# EAGLE design Duckietown 2018C (EAGLE 8.5.2)
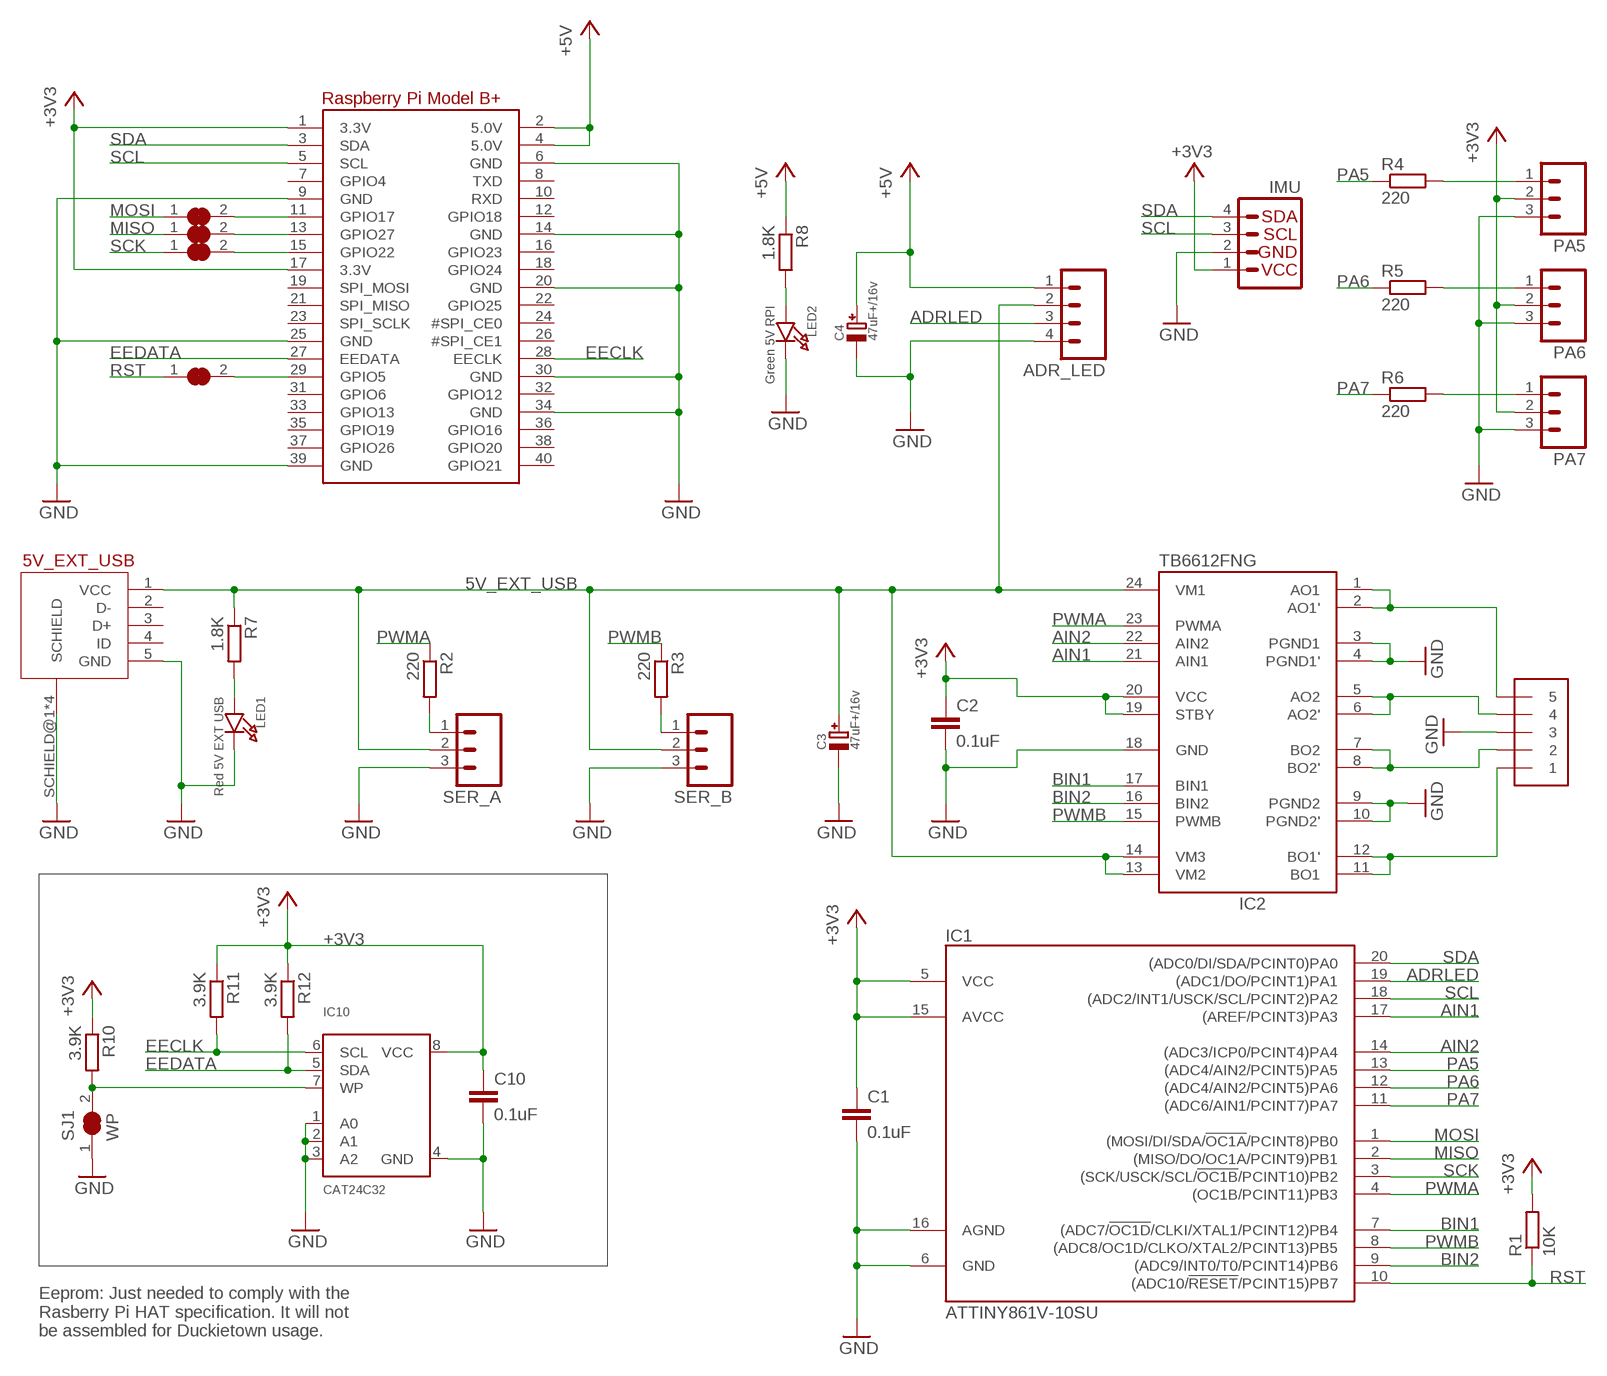
[diagram p0: schematic, sheet 1]

## Parts
5V_EXT_USB  MICROUSBCON  [MICROUSBCON]
ADR_LED  M04PTH  [1X04]
C1  0.1uF  C-EUC0603  [C0603]
C2  0.1uF  C-EUC0603  [C0603]
C3  47uF+/16v  CAP_ELECTROLYTICPANASONIC_C  [PANASONIC_C]
C4  47uF+/16v  CAP_ELECTROLYTICPANASONIC_C  [PANASONIC_C]
C10  0.1uF  C-EUC0603  [C0603]
IC1  ATTINY861V-10SU  [SO20L]
IC2  TB6612FNG  [SSOP24]
IC10  CAT24C32  EEPROM_I2C_SOIC8_GENERIC  [SOIC8_150MIL]
IMU  I2C_IMU_L3GD20H+LSM303  [1X04]
LED1  Red 5V EXT USB  LED0805_NOOUTLINE  [CHIPLED_0805_NOOUTLINE]
LED2  Green 5V RPI  LED0805_NOOUTLINE  [CHIPLED_0805_NOOUTLINE]
MOTA  1X5  [1X05-3.5MM]
PA5  M03PTH  [1X03]
PA6  M03PTH  [1X03]
PA7  M03PTH  [1X03]
R1  10K  R-EU_R0603  [R0603]
R2  220  R-EU_R0603  [R0603]
R3  220  R-EU_R0603  [R0603]
R4  220  R-EU_R0603  [R0603]
R5  220  R-EU_R0603  [R0603]
R6  220  R-EU_R0603  [R0603]
R7  1.8K  R-EU_R0603  [R0603]
R8  1.8K  R-EU_R0603  [R0603]
R10  3.9K  R-EU_R0603  [R0603]
R11  3.9K  R-EU_R0603  [R0603]
R12  3.9K  R-EU_R0603  [R0603]
RP_MISO  SOLDERJUMPER_CLOSED  [SOLDERJUMPER_CLOSEDWIRE]
RP_MOSI  SOLDERJUMPER_CLOSED  [SOLDERJUMPER_CLOSEDWIRE]
RP_RST  SOLDERJUMPER_CLOSED  [SOLDERJUMPER_CLOSEDWIRE]
RP_SCK  SOLDERJUMPER_CLOSED  [SOLDERJUMPER_CLOSEDWIRE]
RPI2  RASPBERRYPI_BPLUS_HATSLOTS  [PI_HAT_SLOTS]
SER_A  M03PTH  [1X03]
SER_B  M03PTH  [1X03]
SJ1  WP  SOLDERJUMPER_CLOSED  [SOLDERJUMPER_CLOSEDWIRE]

## Nets
5V_EXT_USB [Power]: 5V_EXT_USB.1(VCC) ADR_LED.2 C3.+ IC2.13(VM2) IC2.14(VM3) IC2.24(VM1) R7.1 SER_A.2 SER_B.2
+3V3 [Supply]: C1.1 C2.1 C10.1 IC1.5(VCC) IC1.15(AVCC) IC2.19(STBY) IC2.20(VCC) IC10.8(VCC) IMU.1 PA5.2 PA6.2 PA7.2 R1.2 R10.1 R11.1 R12.1 RPI2.1(3.3V) RPI2.17(3.3V)
+5V [Power]: ADR_LED.1 C4.+ R8.1 RPI2.2(5.0V) RPI2.4(5.0V)
ADRLED: ADR_LED.3 IC1.19((ADC1/DO/PCINT1)PA1)
AIN1: IC1.17((AREF/PCINT3)PA3) IC2.21(AIN1)
AIN2: IC1.14((ADC3/ICP0/PCINT4)PA4) IC2.22(AIN2)
BIN1: IC1.7((ADC7/!OC1D!/CLKI/XTAL1/PCINT12)PB4) IC2.17(BIN1)
BIN2: IC1.9((ADC9/INT0/T0/PCINT14)PB6) IC2.16(BIN2)
EECLK: IC10.6(SCL) R11.2 RPI2.28(EECLK)
EEDATA: IC10.5(SDA) R12.2 RPI2.27(EEDATA)
GND: 5V_EXT_USB.5(GND) 5V_EXT_USB.SCHIELD@1(SCHIELD) 5V_EXT_USB.SCHIELD@2(SCHIELD) 5V_EXT_USB.SCHIELD@3(SCHIELD) 5V_EXT_USB.SCHIELD@4(SCHIELD) ADR_LED.4 C1.2 C2.2 C3.- C4.- C10.2 IC1.6(GND) IC1.16(AGND) IC2.3(PGND1) IC2.4(PGND1') IC2.9(PGND2) IC2.10(PGND2') IC2.18(GND) IC10.1(A0) IC10.2(A1) IC10.3(A2) IC10.4(GND) IMU.2 LED1.C LED2.C MOTA.3 PA5.3 PA6.3 PA7.3 RPI2.6(GND) RPI2.9(GND) RPI2.14(GND) RPI2.20(GND) RPI2.25(GND) RPI2.30(GND) RPI2.34(GND) RPI2.39(GND) SER_A.3 SER_B.3 SJ1.1
MISO: IC1.2((MISO/DO/OC1A/PCINT9)PB1) RP_MISO.1
MOSI: IC1.1((MOSI/DI/SDA/!OC1A!/PCINT8)PB0) RP_MOSI.1
N$1: LED2.A R8.2
N$11 [Power]: IC2.5(AO2) IC2.6(AO2') MOTA.4
N$12 [Power]: IC2.7(BO2) IC2.8(BO2') MOTA.2
N$13: LED1.A R7.2
N$16: IC10.7(WP) R10.2 SJ1.2
N$17 [Power]: IC2.11(BO1) IC2.12(BO1') MOTA.1
N$18 [Power]: IC2.1(AO1) IC2.2(AO1') MOTA.5
N$20: R2.2 SER_A.1
N$22: PA5.1 R4.2
N$23: R3.2 SER_B.1
N$24: PA6.1 R5.2
N$25: PA7.1 R6.2
N$43: RP_SCK.2 RPI2.15(GPIO22)
N$44: RP_MISO.2 RPI2.13(GPIO27)
N$46: RP_MOSI.2 RPI2.11(GPIO17)
N$48: RP_RST.2 RPI2.29(GPIO5)
PA5: IC1.13((ADC4/AIN2/PCINT5)PA5) R4.1
PA6: IC1.12((ADC4/AIN2/PCINT5)PA6) R5.1
PA7: IC1.11((ADC6/AIN1/PCINT7)PA7) R6.1
PWMA: IC1.4((OC1B/PCINT11)PB3) IC2.23(PWMA) R2.1
PWMB: IC1.8((ADC8/OC1D/CLKO/XTAL2/PCINT13)PB5) IC2.15(PWMB) R3.1
RST: IC1.10((ADC10/!RESET!/PCINT15)PB7) R1.1 RP_RST.1
SCK: IC1.3((SCK/USCK/SCL/!OC1B!/PCINT10)PB2) RP_SCK.1
SCL: IC1.18((ADC2/INT1/USCK/SCL/PCINT2)PA2) IMU.3 RPI2.5(SCL)
SDA: IC1.20((ADC0/DI/SDA/PCINT0)PA0) IMU.4 RPI2.3(SDA)
Unconnected: 5V_EXT_USB.2(D-) 5V_EXT_USB.3(D+) 5V_EXT_USB.4(ID) RPI2.7(GPIO4) RPI2.8(TXD) RPI2.10(RXD) RPI2.12(GPIO18) RPI2.16(GPIO23) RPI2.18(GPIO24) RPI2.19(SPI_MOSI) RPI2.21(SPI_MISO) RPI2.22(GPIO25) RPI2.23(SPI_SCLK) RPI2.24(#SPI_CE0) RPI2.26(#SPI_CE1) RPI2.31(GPIO6) RPI2.32(GPIO12) RPI2.33(GPIO13) RPI2.35(GPIO19) RPI2.36(GPIO16) RPI2.37(GPIO26) RPI2.38(GPIO20) RPI2.40(GPIO21)

## Notes on the sheet
- Eeprom: Just needed to comply with the
  Rasberry Pi HAT specification. It will not
  be assembled for Duckietown usage.

## Library data of the parts
5V_EXT_USB = USB Connector:MICROUSBCON: Digi-Key 609-4618-1-ND Amphenol FCI 10118194-0001LF Description CONN USB MICRO B RECPT SMT R/A
ADR_LED = DuckietownTrafficLight:M04: Header 4 Standard 4-pin 0.1" header. Use with straight break away headers (SKU : PRT-00116), right angle break away headers (PRT-00553), swiss pins (PRT-00743), machine pins (PRT-00117), and female headers (PRT-00115). Molex polarized connector foot print use with SKU : PRT-08231 with associated crimp pins and housings. 1MM SMD Version SKU: PRT-10208
C1 C2 C10 = rcl:C-EU: CAPACITOR, European symbol; SPICEPREFIX: C
C3 C4 = microbuilder:CAP_ELECTROLYTIC: Electrolytic Capacitors SMT PANASONIC_C - Size C Panasonic Electrolytic Aluminum Capacitor 47µF 16V 20% Electrolytic Capacitor [Digikey: PCE3890TR-ND] PANASONIC_D - Size D Panasonic Electrolytic Aluminum Capacitor 100µF 25V 20% Electrolytic Capacitor [Digikey: PCE3898TR-ND] PTH 3.5 mm grid, 8 mm diameter ... 3.5 mm grid, 10 mm diameter ...
IC1 = Attiny86:ATTINY861V-10SU
IC2 = DuckietownTrafficLight:TB6612FNG: TB6612FNG MOS dual H-bridge motor driver, 1.2A current 3.2A peak 3 or 5v logic and 3-15v motor
IC10 = microbuilder:EEPROM_I2C_SOIC8_GENERIC: Note: The same pinout is used for many I2C EEPROMs in SOIC8(150mil) from a variety of manufacturers and in various sizes. Examples: 16K (2K x 8 Bit) I2C EEPROM 1.7-5.5V, 400KHz, -40°C-85°C Digikey: CAT24C16WI-GT3CT-ND 256K (32K x 8 Bit) I2C EEPROM 1.7-5.5V, 400KHz, -40°C-85°C Digikey: 24AA256-I/SN-ND
IMU = cambridge_garage_electronics:I2C_IMU_L3GD20H+LSM303: SparkFun has standardized on a pinout for all I2C based sensor breakouts. This pinout allows I2C boards to be plugged directly into the headers on Arduino Uno compatible boards, and to be daisy chained easily.
LED1 LED2 = microbuilder:LED: LED 0603 - 0603 Surface Mount Package 2mA: Green LED - Low Power (3.9mcd, 2ma, 1.7Vf) - Digikey: 475-2709-2-ND Orange LED - Low Power (9.8mcd, 2ma, 1.8Vf) - Digikey: 475-1194-2-ND Red LED - Low Power (5mcd, 2ma, 1.8Vf) - Digikey: 475-1195-2-ND Yellow LED - Low Power (7mcd, 2ma, 1.8Vf) - Digikey: 475-1196-2-ND 5mA: Blue LED - Low Power (17mcd, 5ma, 2.9Vf) - Digikey: LNJ937W8CRACT-ND 0805 - 0805 Surface Mount Package 2mA: Red LED (8.8mcd, 2mA, 1.8Vf, Clear) - Low Power [Digikey: 475-2510-1-ND] Green LED (5mcd, 2mA, 1.8Vf, Clear) - Low Power [Digikey: 475-2730-1-ND] Yellow LED (11.3mcd, 2mA, 1.8Vf, Clear) - Low Power [Digikey: 475-2555-1-ND] 20mA: Red LED (104mcd, 20mA, Diffused) - LS R976 [Digikey: 475-1278-6-ND] Red LED (12mcd, 20mA, 2.0Vf, Clear) - APT2012EC [Digikey: 754-1128-1-ND] Green LED (15mcd, 20mA, 2.2Vf, Clear) - APT2012GC [Digikey: 754-1131-1-ND] Orange LED (160mcd, 20mA, 2.1Vf, Clear) - APT2012SECK [Digikey: 754-1130-1-ND] 1206 - 1206 Surface Mount Package Green LED (26mcd, 20mA, Diffused) - LG N971 [Digikey: 475-1407-6-ND] Red LED (15mcd, 20mA, Diffused) - LH N974 [Digikey: 475-1416-6-ND] Cree - Cree High-Power Surface Mount LEDs XPEBWT-L1-0000-00D50 - White 111lm 350mA 2.9Vf 6200K 110° XTEAWT-00-0000-00000LEE3 - White 114lm 350mA 2.85Vf 5000K 115° Everlight - Everlight 45-21 Series Surface Mount LEDs 45-21/QK2C-B2832AC2CB2/2T - Warm White 2000mcd 20mA 3.25Vf 3050K 120° 45-21/LK2C-B38452C4CB2/2T - Nuetral White 2000mcd 20mA 3.25Vf 4150K 120° 45-21/LK2C-B50634C6CB2/2T - Cold White 2200mcd 20mA 3.25Vf 5650K 120° PLCC2 Reverse Mount LS T77K-J1L2-1-0-2-R18-Z - Red 11.25mcd 2mA 1.8Vf 630nm 120° LO T77K-L1M2-24-Z - Orange 19.6mcd 2mA 1.8Vf 606nm 120° LY T77K-K2M1-26-Z - Yellow 15.7mcd 2mA 1.8Vf 587nm 120°
MOTA = DuckietownTrafficLight:1X5
PA5-PA7 SER_A SER_B = cambridge_garage_electronics:M03: Header 3 Standard 3-pin 0.1" header. Use with straight break away headers (SKU : PRT-00116), right angle break away headers (PRT-00553), swiss pins (PRT-00743), machine pins (PRT-00117), and female headers (PRT-00115). Molex polarized connector foot print use with SKU : PRT-08232 with associated crimp pins and housings.
R1-R8 R10-R12 = rcl:R-EU_: RESISTOR, European symbol; SPICEPREFIX: R
RP_MISO RP_MOSI RP_RST RP_SCK SJ1 = DuckietownTrafficLight:SOLDERJUMPER_CLOSED: Solder Jumper - Closed These solder jumpers are closed by default CLOSEDWIRE - 10 mil trace between pads that can be cut and resoldered later CLOSEDPERM - 63 mil trace between pads for a permanent connection (used to 'bridge' two signals, a shameless hack for Eagle). Can double as a test point as well (no cream layer)
RPI2 = DuckietownTrafficLight:RASPBERRYPI_BPLUS

## Net classes
0 default: width 0.406 mm, drill 0.406 mm
1 Power: width 0.813 mm, drill 0.813 mm
2 Supply: width 0.61 mm, drill 0.61 mm

## Board
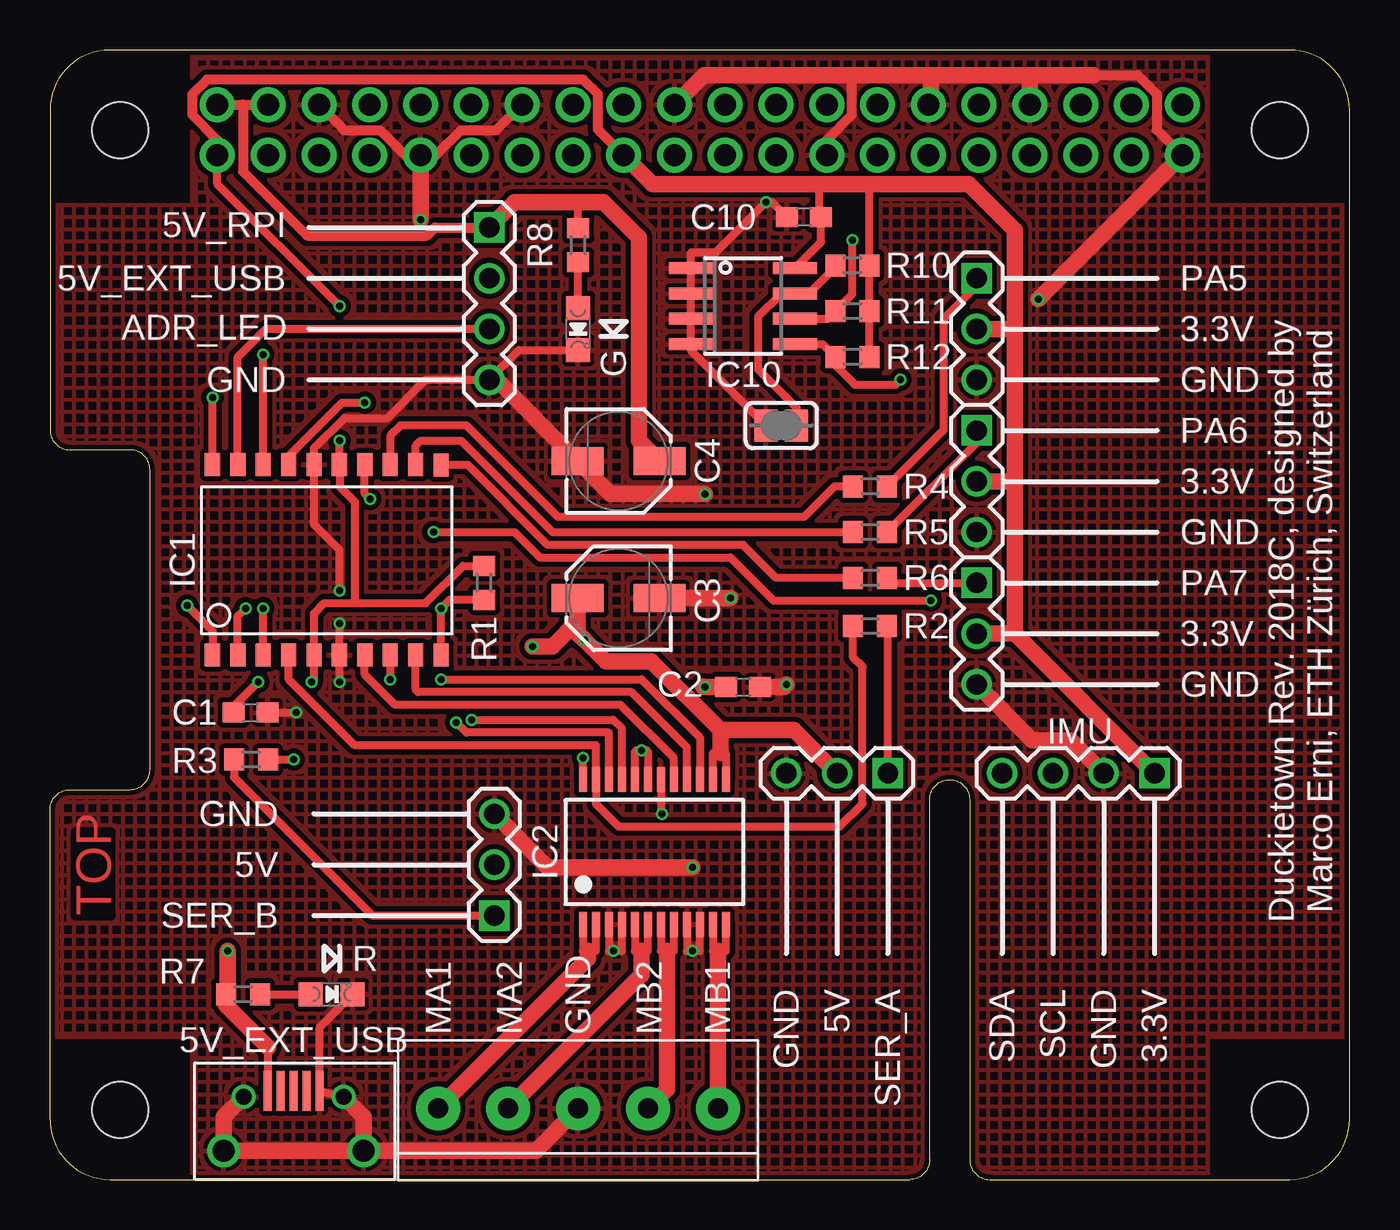
[diagram p1: board, top side]
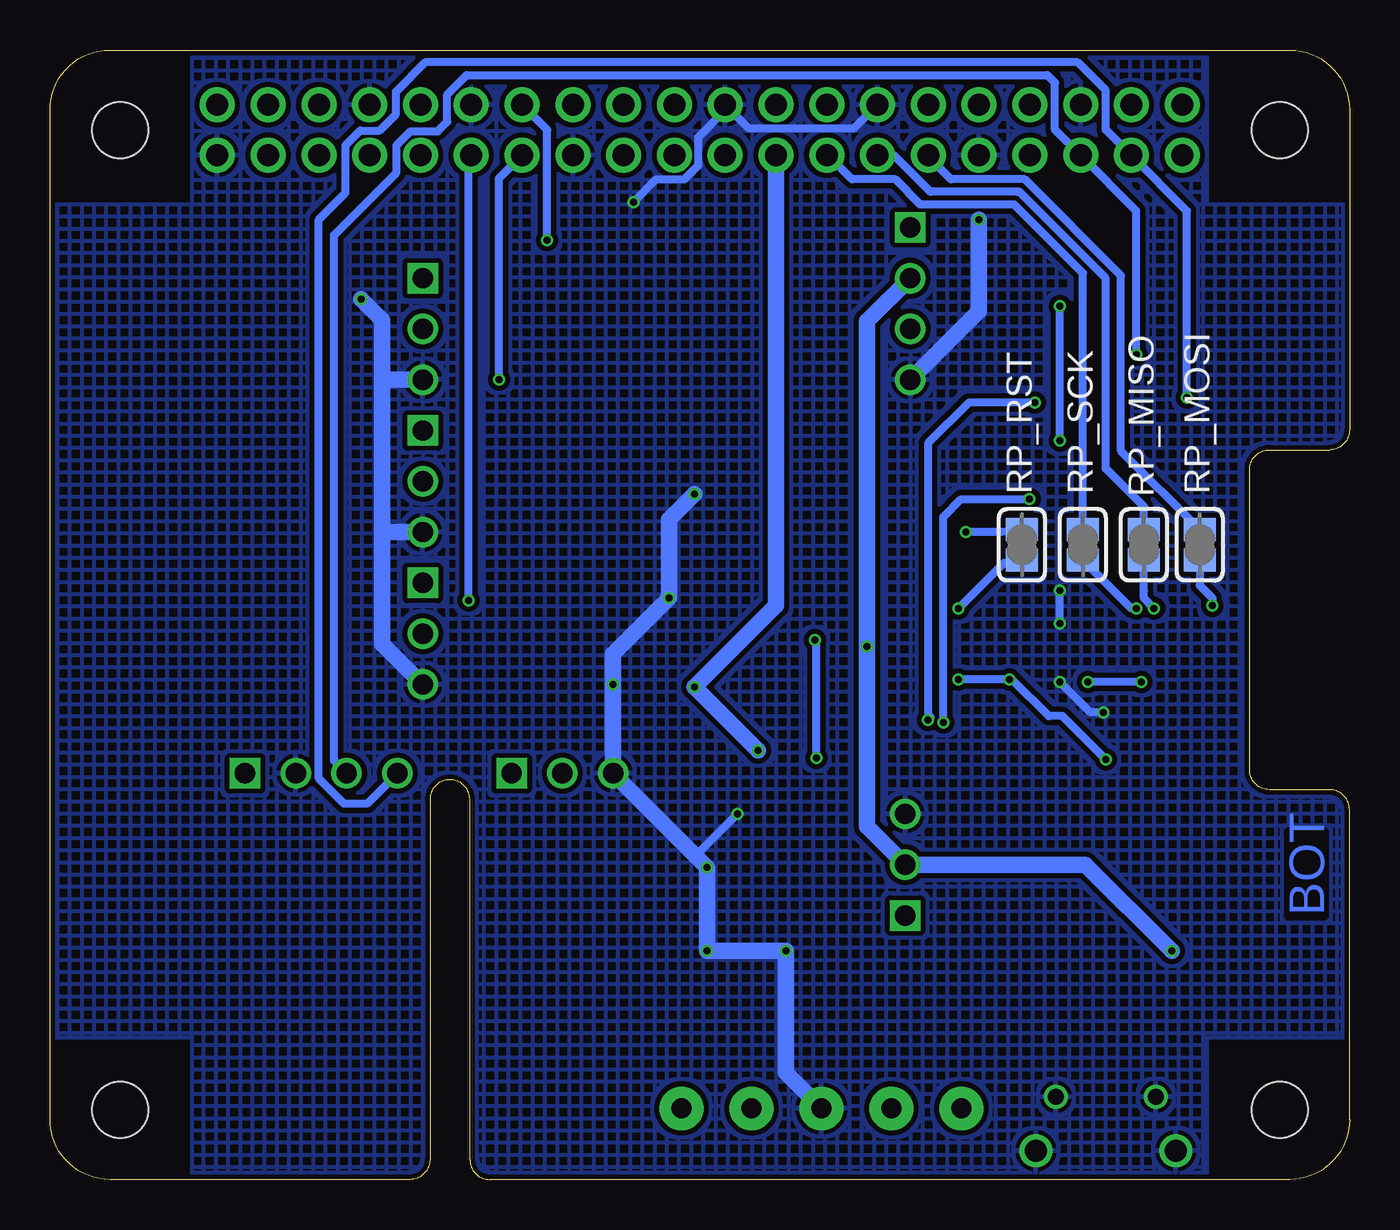
[diagram p2: board, bottom side, seen from below]

Size 65 x 56.5 mm. Coordinates in mm from the lower left corner, seen from the top.
Copper layers (1*16): Top 0.018mm / dielectric 1.55mm / Bottom 0.018mm
Design rules "Multi-CB_2L_125um-Tracks_OL35um *": minimum track width 0.125mm, minimum drill 0.2mm, track to track 0.125mm, track to pad 0.125mm, pad to pad 0.125mm, via to via 0.125mm, smd to smd 0mil, copper to edge 0.2mm, drill to drill 0.2mm, minimum pad ring 0.125mm, minimum via ring 0.125mm, stop-mask expansion 2mil, vias tented up to drill 0.45mm, thermal gap 0.2mm

### Footprints (pad centres in the part's own frame; a part is rotated, then mirrored left to right if it is on the bottom)
MICROUSBCON = smd 0.4 x 2: 1 -1.3,4.45; 2 -0.65,4.45; 3 0,4.45; 4 0.65,4.45; 5 1.3,4.45 | drill 0.8: SCHIELD@1 -2.5,4.15; SCHIELD@2 2.5,4.15 | drill 1.1: SCHIELD@3 -3.5,1.45; SCHIELD@4 3.5,1.45
1X04 = drill 1.016 pad 1.524 square: 1 0,0 | drill 1.016 pad 1.524: 2 2.54,0; 3 5.08,0; 4 7.62,0
C0603 = smd 1.1 x 1: 1 -0.85,0; 2 0.85,0
PANASONIC_C = smd 2.6 x 1.4: + 2.05,0; - -2.05,0
SO20L = smd 0.762 x 1.143: 1 -5.08,-5.131; 2 -3.81,-5.131; 3 -2.54,-5.131; 4 -1.27,-5.131; 5 0,-5.131; 6 1.27,-5.131; 7 2.54,-5.131; 8 3.81,-5.131; 9 5.08,-5.131; 10 6.35,-5.131; 11 6.35,4.369; 12 5.08,4.394; 13 3.81,4.394; 14 2.54,4.394; 15 1.27,4.394; 16 0,4.394; 17 -1.27,4.394; 18 -2.54,4.394; 19 -3.81,4.394; 20 -5.08,4.394
SSOP24 = smd 0.4 x 1.25: 1 -3.575,-3.625; 2 -2.925,-3.625; 3 -2.275,-3.625; 4 -1.625,-3.625; 5 -0.975,-3.625; 6 -0.325,-3.625; 7 0.325,-3.625; 8 0.975,-3.625; 9 1.625,-3.625; 10 2.275,-3.625; 11 2.925,-3.625; 12 3.575,-3.625; 13 3.575,3.625; 14 2.925,3.625; 15 2.275,3.625; 16 1.625,3.625; 17 0.975,3.625; 18 0.325,3.625; 19 -0.325,3.625; 20 -0.975,3.625; 21 -1.625,3.625; 22 -2.275,3.625; 23 -2.925,3.625; 24 -3.575,3.625
SOIC8_150MIL = smd 0.6 x 2.2: 1 -1.905,-2.6; 2 -0.635,-2.6; 3 0.635,-2.6; 4 1.905,-2.6; 5 1.905,2.6; 6 0.635,2.6; 7 -0.635,2.6; 8 -1.905,2.6
CHIPLED_0805_NOOUTLINE = smd 1.2 x 1.2: A 0,-1.05; C 0,1.05
1X05-3.5MM = drill 1 pad 2.184: 1 7,0; 2 3.5,0; 3 0,0; 4 -3.5,0; 5 -7,0
1X03 = drill 1.016 pad 1.524 square: 1 0,0 | drill 1.016 pad 1.524: 2 2.54,0; 3 5.08,0
R0603 = smd 1 x 1.1: 1 -0.85,0; 2 0.85,0
SOLDERJUMPER_CLOSEDWIRE = smd 1.168 x 1.6: 1 -0.762,0; 2 0.762,0 | smd 0.635 x 0.305: WIRE 0,0
PI_HAT_SLOTS = drill 1.1 pad 1.75: 1 8.37,51.23; 2 8.37,53.77; 3 10.91,51.23; 4 10.91,53.77; 5 13.45,51.23; 6 13.45,53.77; 7 15.99,51.23; 8 15.99,53.77; 9 18.53,51.23; 10 18.53,53.77; 11 21.07,51.23; 12 21.07,53.77; 13 23.61,51.23; 14 23.61,53.77; 15 26.15,51.23; 16 26.15,53.77; 17 28.69,51.23; 18 28.69,53.77; 19 31.23,51.23; 20 31.23,53.77; 21 33.77,51.23; 22 33.77,53.77; 23 36.31,51.23; 24 36.31,53.77; 25 38.85,51.23; 26 38.85,53.77; 27 41.39,51.23; 28 41.39,53.77; 29 43.93,51.23; 30 43.93,53.77; 31 46.47,51.23; 32 46.47,53.77; 33 49.01,51.23; 34 49.01,53.77; 35 51.55,51.23; 36 51.55,53.77; 37 54.09,51.23; 38 54.09,53.77; 39 56.63,51.23; 40 56.63,53.77 | hole 2.8: 3.5,3.5; 3.5,52.5; 61.5,52.5; 61.5,3.5

### Placement (x,y rotation side)
5V_EXT_USB  12.19,0 0 top
ADR_LED  21.97,47.62 270 top
C1  10.03,23.37 0 top
C2  34.67,24.64 0 top
C3  28.45,29.08 180 top
C4  28.45,35.94 0 top
C10  37.72,48.13 180 top
IC1  13.21,31.37 0 top
IC2  30.23,16.38 0 top
IC10  34.67,43.69 270 top
IMU  55.24,20.32 180 top
LED1  14.1,9.27 270 top
LED2  26.42,42.55 180 top
MOTA  26.42,3.56 0 top
PA5  46.35,45.09 270 top
PA6  46.35,37.47 270 top
PA7  46.35,29.84 270 top
R1  21.72,29.84 90 top
R2  41.02,27.69 0 top
R3  10.06,21.01 180 top
R4  41.02,34.67 0 top
R5  41.02,32.38 0 top
R6  41.02,30.1 0 top
R7  9.65,9.27 0 top
R8  26.42,46.74 270 top
R10  40.13,45.72 180 top
R11  40.13,43.43 180 top
R12  40.13,41.15 180 top
RP_MISO  10.29,31.75 90 bottom
RP_MOSI  7.49,31.75 90 bottom
RP_RST  16.38,31.75 90 bottom
RP_SCK  13.34,31.75 90 bottom
RPI2  0,0 0 top
SER_A  41.91,20.32 180 top
SER_B  22.23,13.21 90 top
SJ1  36.58,37.72 0 top

### Tracks (layer width: path | path; a pad name or v marks a point on that pad's centre or on a via)
5V_EXT_USB  (via drill 0.35)
  Top 0.406: IC2.14 33.15,21.33 | 33.15,21.33 33.15,21.34 | 33.78,21.34 33.79,21.33 | IC2.13 33.8,21.32 33.79,21.33 | 33.15,21.33 33.53,21.33 33.79,21.33 | IC2.24 26.65,21.06 v26.67,21.08 | 10.92,6.6 10.89,6.57 5V_EXT_USB.1
  Top 0.813: 33.53,21.33 33.53,22.48 | 26.4,27.94 26.4,27.32 v26.73,26.99 27.81,25.91 30.1,25.91 33.53,22.48 | 26.4,27.94 C3.+ | SER_A.2 37.21,22.48 33.53,22.48 | 26.4,27.94 25.13,26.67 v24.13,26.67 | v8.89,11.43 8.89,9.36 R7.1 8.8,8.72 10.92,6.6
  Bottom 0.406: v26.67,21.08 26.67,26.92 v26.73,26.99
  Bottom 0.813: ADR_LED.2 24.13,42.93 v24.13,26.67 24.13,17.65 SER_B.2 13.21,15.75 v8.89,11.43
+3V3  (via drill 0.35)
  Top 0.406: R12.1 R11.1 R10.1 40.98,49.44 40.64,49.78 | v13.08,24.89 13.21,25.02 IC1.5 13.21,28.32 13.72,28.83 15.24,28.83 | R1.2 20.66,30.7 18.8,28.83 15.24,28.83 | 15.24,28.83 15.24,33.91 14.48,34.67 IC1.15 v14.48,36.96 | IC2.20 29.25,21.38 29.34,21.46 v29.59,21.46 29.84,21.46 29.9,21.41 IC2.19 | IC10.8 38.57,46.89 C10.1 38.48,48.22 38.48,49.78 | C1.1 9.18,23.66 v10.41,24.89 | v14.48,43.69 8.37,49.8 RPI2.1
  Top 0.508: RPI2.17 27.4,52.52 27.4,54.29 26.67,55.02 7.85,55.02 7.12,54.29 7.12,53.25 8.37,52 RPI2.1
  Top 0.813: C2.1 v32.77,24.64 32.7,24.64 32.67,24.67 | RPI2.17 30.14,49.78 38.48,49.78 40.64,49.78 45.97,49.78 48.26,47.5 48.26,42.55 | 48.26,42.55 48.26,35.05 | 48.26,35.05 48.26,27.3 | PA6.2 48.13,34.92 48.26,35.05 | PA5.2 48.26,42.55 | IMU.1 48.26,27.3 | PA7.2 48.26,27.3
  Bottom 0.406: v10.41,24.89 v13.08,24.89 | v14.48,36.96 v14.48,43.69
  Bottom 0.813: v29.59,21.46 v32.77,24.64 28.69,28.71 RPI2.17
+5V
  Top 0.406: R8.1 26.42,48.9
  Top 0.508: RPI2.2 9.65,53.77 | 9.65,53.77 RPI2.4 | 9.65,53.77 9.65,50.42 12.85,47.22 18.86,47.22 19.26,47.62 ADR_LED.1
  Top 0.813: C4.+ 29.46,36.98 29.46,47.12 27.69,48.9 26.42,48.9 23.24,48.9 ADR_LED.1
ADRLED
  Top 0.406: ADR_LED.3 10.79,42.55 9.4,41.15 IC1.19
AIN1  (via drill 0.35)
  Top 0.406: IC2.21 28.6,22.58 28.19,22.99 v21.08,22.99 | IC1.17 11.94,36.2 14.61,38.86 v15.75,38.86
  Bottom 0.406: 20.95,23.12 v21.08,22.99 21.08,36.83 19.05,38.86 v15.75,38.86
AIN2  (via drill 0.35)
  Top 0.406: v16,34.04 15.75,34.29 IC1.14 | IC2.22 27.95,22.34 27.94,22.35 20.83,22.35 v20.32,22.86
  Bottom 0.406: v20.32,22.86 20.32,33.15 19.43,34.04 v16,34.04
BIN1
  Top 0.406: IC2.17 31.2,21.08 28.53,23.75 17.27,23.75 15.75,25.27 IC1.7
BIN2
  Top 0.406: IC2.16 31.85,21.62 29.08,24.38 18.41,24.38 18.29,24.51 IC1.9
EECLK  (via drill 0.35)
  Top 0.406: IC10.6 38.9,43.05 R11.2 40.13,44.28 v40.13,46.99
  Bottom 0.406: v40.13,46.99 40.13,52.51 RPI2.28
EEDATA  (via drill 0.35)
  Top 0.406: IC10.5 38.65,41.78 R12.2 39.28,40.73 40.26,39.75 42.29,39.75 v42.55,40.01
  Bottom 0.406: RPI2.27 42.55,50.08 v42.55,40.01
GND  (via drill 0.35)
  Top 0.406: IC2.9 31.85,11.43 v32.13,11.43 32.5,11.43 IC2.10 | IC2.3 27.95,11.43 v28.19,11.43 28.6,11.43 IC2.4 | C1.2 v12.32,23.37 | v14.48,24.89 IC1.6 v14.48,27.81 | v14.48,29.46 14.48,31.5 13.21,32.77 IC1.16 13.21,36.58 14.73,38.1 16.89,38.1 18.8,40.01 ADR_LED.4 23.46,41.49 LED2.C 26.32,41.4 | IC2.18 30.55,18.34 v30.61,18.29 | 5V_EXT_USB.SCHIELD@2 5V_EXT_USB.5 13.49,7.62 LED1.C | SJ1.1 32.07,41.46 IC10.4 IC10.3 IC10.2 IC10.1 32.07,46.38 33.3,46.38 v35.81,48.9 36.11,48.9 C10.2
  Top 0.508: RPI2.6 14.74,52.48 16.51,52.48 17.76,51.23 RPI2.9 19.3,51.23 20.55,52.48 22.32,52.48 RPI2.14 | RPI2.25 38.85,52 40.1,53.25 40.1,55.09 40.26,55.24 | 52.2,55.24 54.41,55.24 55.36,54.3 55.36,52.5 RPI2.39
  Top 0.813: 5V_EXT_USB.SCHIELD@1 8.69,3.15 5V_EXT_USB.SCHIELD@3 5V_EXT_USB.SCHIELD@4 | 5V_EXT_USB.SCHIELD@4 15.69,3.15 5V_EXT_USB.SCHIELD@2 | 5V_EXT_USB.SCHIELD@4 24.31,1.45 MOTA.3 | C2.2 36.7,24.64 v36.83,24.77 | RPI2.9 v18.53,48.01 | PA7.3 49.15,21.97 51.05,21.97 IMU.2 | RPI2.20 32.7,55.24 40.26,55.24 44.07,55.24 | 44.07,55.24 49.02,55.24 | 49.02,55.24 52.2,55.24 | RPI2.30 44.07,53.91 44.07,55.24 | RPI2.34 49.02,53.78 49.02,55.24 | v49.44,44.04 RPI2.39 | v32.77,34.29 28.05,34.29 C4.- 22.33,40.01 ADR_LED.4 | C3.- v34.04,29.08 | SER_B.3 24.89,15.62 v32.13,15.62
  Bottom 0.406: v12.32,23.37 12.95,23.37 v14.48,24.89 | v14.48,27.81 v14.48,29.46 | v30.61,18.29 32.7,16.19 | RPI2.14 24.81,52.57 30.03,52.57 RPI2.20 31.23,53.48 32.57,52.14 32.57,50.73 33.27,50.03 34.68,50.03 v35.81,48.9
  Bottom 0.813: MOTA.3 28.19,5.33 v28.19,11.43 v32.13,11.43 v32.13,15.62 32.7,16.19 SER_A.3 v36.83,24.77 36.83,26.29 v34.04,29.08 34.04,33.02 v32.77,34.29 | PA7.3 48.39,26.8 48.39,32.38 | v49.44,44.04 48.39,42.99 48.39,40.01 | 48.39,32.38 48.39,40.01 | PA6.3 48.39,32.38 | PA5.3 48.39,40.01 | ADR_LED.4 18.54,43.43 18.54,47.99 v18.53,48.01
  pour Top (isolate 0.254, hatched): 7.11,0 7.11,7.11 0,7.11 0,48.77 7.11,48.77 7.11,56.39 57.91,56.39 57.91,48.77 65.02,48.77 65.02,7.11 57.91,7.11 57.91,0
  pour Bottom (isolate 0.254, hatched): 7.11,0 7.11,7.11 0,7.11 0,48.77 7.11,48.77 7.11,56.39 57.91,56.39 57.91,48.77 65.02,48.77 65.02,7.11 57.91,7.11 57.91,0
MISO  (via drill 0.35)
  Top 0.406: v9.78,28.57 9.4,28.19 IC1.2
  Bottom 0.406: 10.29,29.46 RP_MISO.1 10.29,29.08 v9.78,28.57
MOSI  (via drill 0.35)
  Top 0.406: v6.86,28.7 8.13,27.43 IC1.1
  Bottom 0.406: RP_MOSI.1 7.49,29.72 6.86,29.08 v6.86,28.7
N$1
  Top 0.406: LED2.A R8.2
N$11
  Top 0.406: IC2.6 29.9,11.43 29.59,11.43 29.25,11.43 IC2.5
  Top 0.813: MOTA.4 29.59,10.23 29.59,11.43
N$12
  Top 0.406: IC2.7 30.55,11.43 30.86,11.43 31.2,11.43 IC2.8
  Top 0.813: MOTA.2 30.86,4.5 30.86,11.43
N$13
  Top 0.406: R7.2 LED1.A
N$16
  Top 0.406: R10.2 39.28,45.63 37.97,44.32 IC10.7 36.58,44.32 35.43,43.18 35.43,40.51 37.34,38.61 SJ1.2
N$17
  Top 0.406: IC2.11 33.15,11.43 33.4,11.43 | IC2.12 33.8,11.43 33.42,11.43
  Top 0.813: MOTA.1 33.42,11.43 33.4,11.43
N$18
  Top 0.406: IC2.1 26.65,11.43 26.92,11.43 27.3,11.43 IC2.2
  Top 0.813: MOTA.5 26.92,11.06 26.92,11.43
N$20
  Top 0.406: R2.2 41.91,27.65 SER_A.1
N$22
  Top 0.406: R4.2 44.7,37.5 44.7,43.05 46.35,44.7 PA5.1
N$23
  Top 0.406: R3.2 9.21,20.12 16.12,13.21 SER_B.1
N$24
  Top 0.406: R5.2 46.35,36.87 PA6.1
N$25
  Top 0.406: R6.2 42.12,29.84 PA7.1
N$43
  Bottom 0.406: RPI2.15 26.08,51.23 24.88,50.03 22.72,50.03 21.46,48.77 16.76,48.77 13.34,45.34 RP_SCK.2
N$44
  Bottom 0.406: RPI2.13 22.78,51.23 20.95,49.4 16.64,49.4 16.51,49.4 12.19,45.09 12.19,35.56 10.29,33.66 RP_MISO.2
N$46
  Bottom 0.406: RPI2.11 21.07,51.17 19.93,50.03 16.25,50.03 11.43,45.21 11.43,36.45 RP_MOSI.2
N$48  (via drill 0.35)
  Top 0.406: v19.18,32.38 23.24,32.38 24.51,31.11 34.04,31.11 36.2,28.96 v44.07,28.96
  Bottom 0.406: RP_RST.2 17.39,32.4 17.56,32.4 17.57,32.38 v19.18,32.38 | v44.07,28.96 44.07,51.09 RPI2.29
PA5
  Top 0.406: R4.1 39.24,34.67 37.72,33.15 25.4,33.15 20.83,37.72 17.53,37.72 17.02,37.21 IC1.13
PA6
  Top 0.406: IC1.12 18.29,36.7 18.54,36.96 20.57,36.96 25.15,32.38 R5.1
PA7
  Top 0.406: R6.1 36.32,30.1 34.67,31.75 24.89,31.75 20.9,35.74 IC1.11
PWMA
  Top 0.406: IC1.4 11.94,25.02 15.24,21.72 27.3,21.72 27.3,21.71 IC2.23 27.3,18.8 28.45,17.65 39.5,17.65 40.64,18.8 40.64,25.65 40.17,26.12 R2.1
PWMB  (via drill 0.35)
  Top 0.406: IC1.8 v17.02,25.02 | IC2.15 32.5,22.11 29.59,25.02 v19.56,25.02 | R3.1 v12.19,21.01
  Bottom 0.406: v12.19,21.01 14.36,23.18 15.05,23.18 16.89,25.02 v17.02,25.02 v19.56,25.02
RST  (via drill 0.35)
  Top 0.406: IC1.10 v19.56,28.57 19.98,29 R1.1
  Bottom 0.406: v19.56,28.57 17.27,30.86 RP_RST.1
SCK  (via drill 0.35)
  Top 0.406: IC1.3 v10.67,28.57
  Bottom 0.406: v10.67,28.57 10.92,28.57 RP_SCK.1
SCL  (via drill 0.35)
  Top 0.406: IC1.18 v10.67,41.27
  Bottom 0.406: IMU.3 50.8,20.95 50.8,47.24 47.67,50.37 47.67,51.73 46.97,52.43 45.61,52.43 45.13,52.91 45.13,54.27 44.16,55.24 15.11,55.24 14.73,54.86 14.73,52.51 RPI2.5 10.67,48.45 v10.67,41.27
SDA  (via drill 0.35)
  Top 0.406: IC1.20 v8.13,39.12
  Bottom 0.406: IMU.4 49.15,18.8 50.29,18.8 51.56,20.07 51.56,48.01 50.21,49.35 50.21,51.73 49.48,52.47 48.51,52.47 47.69,53.29 47.69,54.42 46.23,55.88 13.59,55.88 12.19,54.48 12.19,52.51 RPI2.3 8.13,48.45 v8.13,39.12

### Text on the board
Top: TOP
Bottom: BOT
tNames: 5V_RPI | 5V_EXT_USB | G | 3.3V | GND | GND | 3.3V | GND | Duckietown Rev. 2018C, designed by / Marco Erni, ETH Zürich, Switzerland | 3.3V | GND | GND | 5V | R | GND | 5V | SDA | SCL | GND | 3.3V | MA1 | MA2 | GND | MB2 | MB1
tValues: ATTINY861V-10SU | TB6612FNG